# Altium project driver.PrjPcb
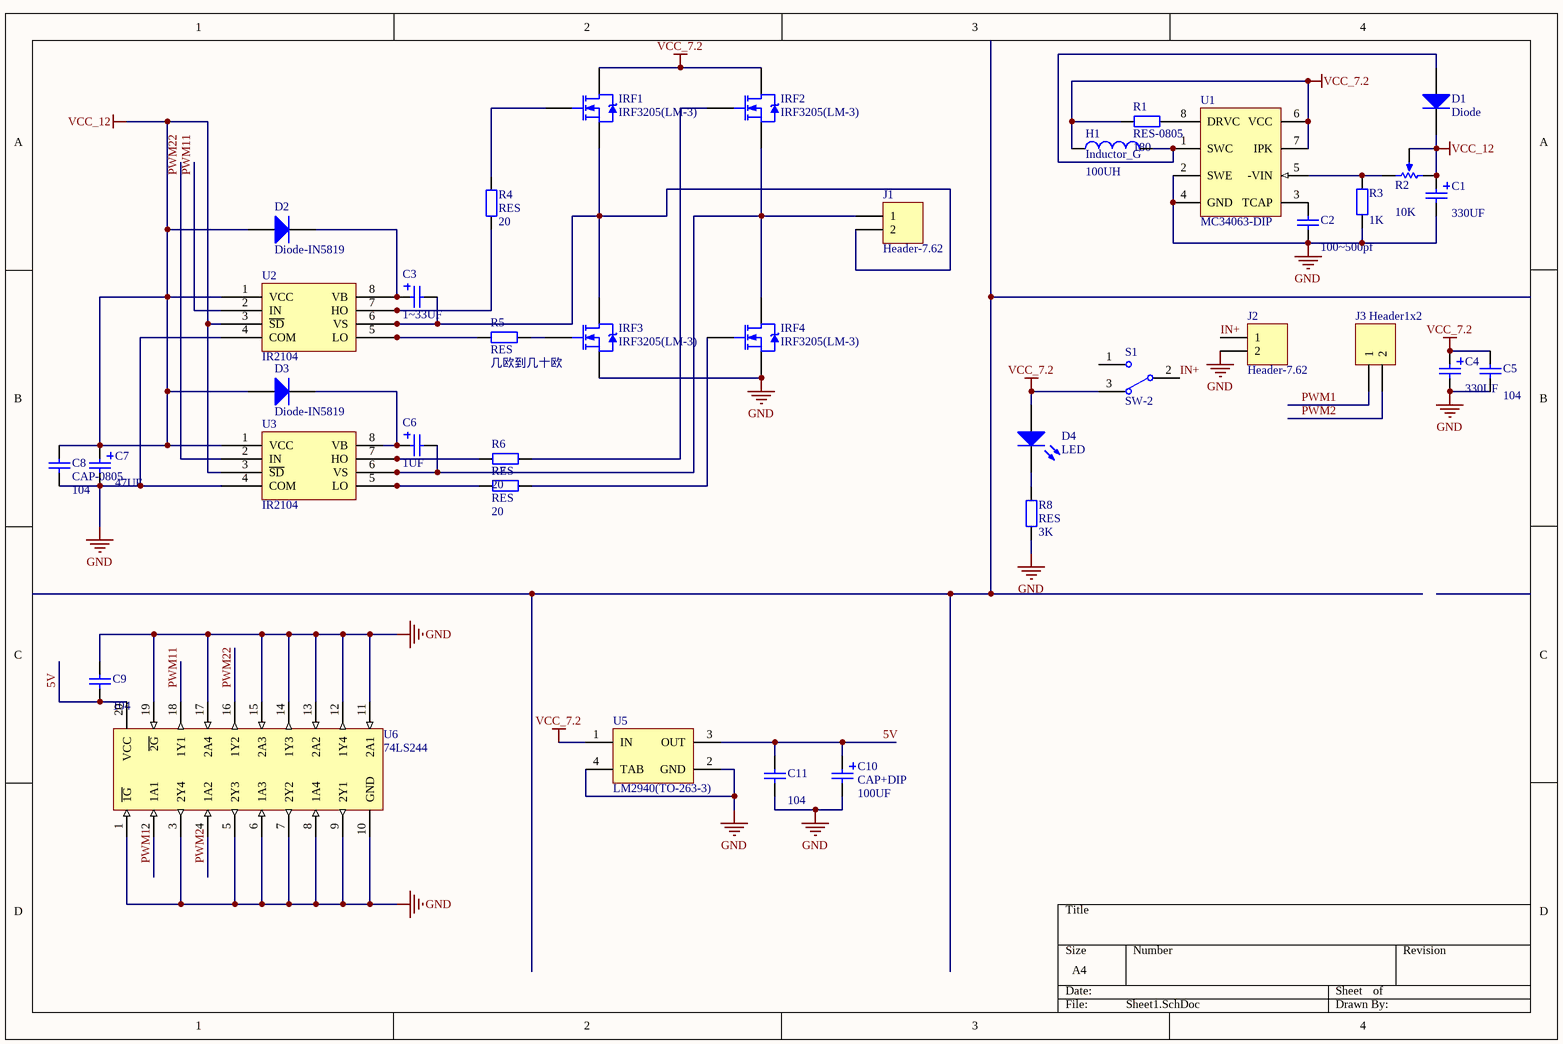
[diagram p0: Sheet1.SchDoc]
1 sheet, 37 parts. Net scope: global (net labels, ports and power ports of the same name join across sheets).
Board file: PCB1.PcbDoc

## Sheet Sheet1.SchDoc
size A4

### Parts
C1  CAP+DIP  [CAP+DIP]  (value not drawn)
C2  CAP-0805  [CAP-0805]  (value not drawn)
C3  CAP+DIP  [CAP+DIP]  (value not drawn)
C4  CAP+DIP  [CAP+DIP]  (value not drawn)
C5  CAP-0805  [CAP-0805]  (value not drawn)
C6  CAP+DIP  [CAP+DIP]  (value not drawn)
C7  CAP+DIP  [CAP+DIP]  (value not drawn)
C8  CAP-0805  [CAP-0805]
C9  CAP-0805  [CAP-0805]  (value not drawn)
C10  CAP+DIP  [CAP+DIP]
C11  CAP-0805  [CAP-0805]  (value not drawn)
D1  Diode  [DIODE-DIP]
D2  Diode-IN5819  [Diode-IN5819]
D3  Diode-IN5819  [Diode-IN5819]
D4  LED  [LED]
H1  Inductor_G  [INDUCTOR-G]
IRF1  IRF3205(LM-3)  [LM-3]
IRF2  IRF3205(LM-3)  [LM-3]
IRF3  IRF3205(LM-3)  [LM-3]
IRF4  IRF3205(LM-3)  [LM-3]
J1  Header-7.62  [HEADER-7.5]
J2  Header-7.62  [HEADER-7.5]
J3  Header1x2  [HEADER1X2]
R1  RES-0805  [RES-0805]
R2  RES-Change  [RES-Change]  (value not drawn)
R3  RES-0805  [RES-0805]  (value not drawn)
R4  RES  [RES]
R5  RES  [RES]
R6  RES  [RES]
R7  RES  [RES]
R8  RES  [RES]
S1  SW-2  [SW-2]
U1  MC34063-DIP  [DIP-8]
U2  IR2104  [SOP-8]
U3  IR2104  [SOP-8]
U5  LM2940(TO-263-3)  [TO-263-3]
U6  74LS244  [DIP-20]

### Nets
GND: C1.2 C2.1 C4.2 C5.1 C7.2 C8.1 C9.2 C10.2 C11.1 IRF3.3(S) IRF4.3(S) J2.2 R3.1 R8.2 U1.2(SWE) U1.4(GND) U2.4(COM) U3.4(COM) U5.2(GND) U5.4(TAB) U6.1(~{1G}) U6.3(2Y4) U6.5(2Y3) U6.6(1A3) U6.7(2Y2) U6.8(1A4) U6.9(2Y1) U6.10(GND) U6.11(2A1) U6.12(1Y4) U6.13(2A2) U6.14(1Y3) U6.15(2A3) U6.17(2A4) U6.19(~{2G})
VCC_7.2: C4.1 C5.2 D4.1(A) H1.1 IRF1.2(D) IRF2.2(D) R1.1 S1.3 U1.6(VCC) U1.7(IPK) U5.1(IN)
VCC_12: C1.1 C7.1 C8.2 D1.2(K) D2.1(A) D3.1(A) R2.1(TOP) R2.3(TAP) U2.1(VCC) U2.3(~{SD}) U3.1(VCC) U3.3(~{SD})
5V: C9.1 C10.1 C11.2 U5.3(OUT) U6.20(VCC)
IN+: J2.1 S1.2
PWM1: J3.1 U6.2(1A1)
PWM2: J3.2 U6.4(1A2)
PWM11: U2.2(IN) U6.18(1Y1)
PWM22: U3.2(IN) U6.16(1Y2)
NetC2_2: C2.2 U1.3(TCAP)
NetC3_1: C3.1 D2.2(K) U2.8(VB)
NetC3_2: C3.2 IRF1.3(S) IRF3.2(D) J1.2 U2.6(VS)
NetC6_1: C6.1 D3.2(K) U3.8(VB)
NetC6_2: C6.2 IRF2.3(S) IRF4.2(D) J1.1 U3.6(VS)
NetD1_1: D1.1(A) H1.2 U1.1(SWC)
NetD4_2: D4.2(K) R8.1
NetIRF1_1: IRF1.1(G) R4.2
NetIRF2_1: IRF2.1(G) R6.2
NetIRF3_1: IRF3.1(G) R5.1
NetIRF4_1: IRF4.1(G) R7.1
NetR1_2: R1.2 U1.8(DRVC)
NetR2_2: R2.2(BOT) R3.2 U1.5(-VIN)
NetR4_1: R4.1 U2.7(HO)
NetR5_2: R5.2 U2.5(LO)
NetR6_1: R6.1 U3.7(HO)
NetR7_2: R7.2 U3.5(LO)

Not connected (* = marked no-connect by the designer): S1 1

### Notes on the sheet
- (in symbol CAP-0805) 104; 100~500pf
- (in symbol Inductor_G) 100UH
- (in symbol RES-0805) 180; 1K
- (in symbol CAP) 104